# Altium schematic sheet HCMS-39XXTOP.SchDoc
size A4
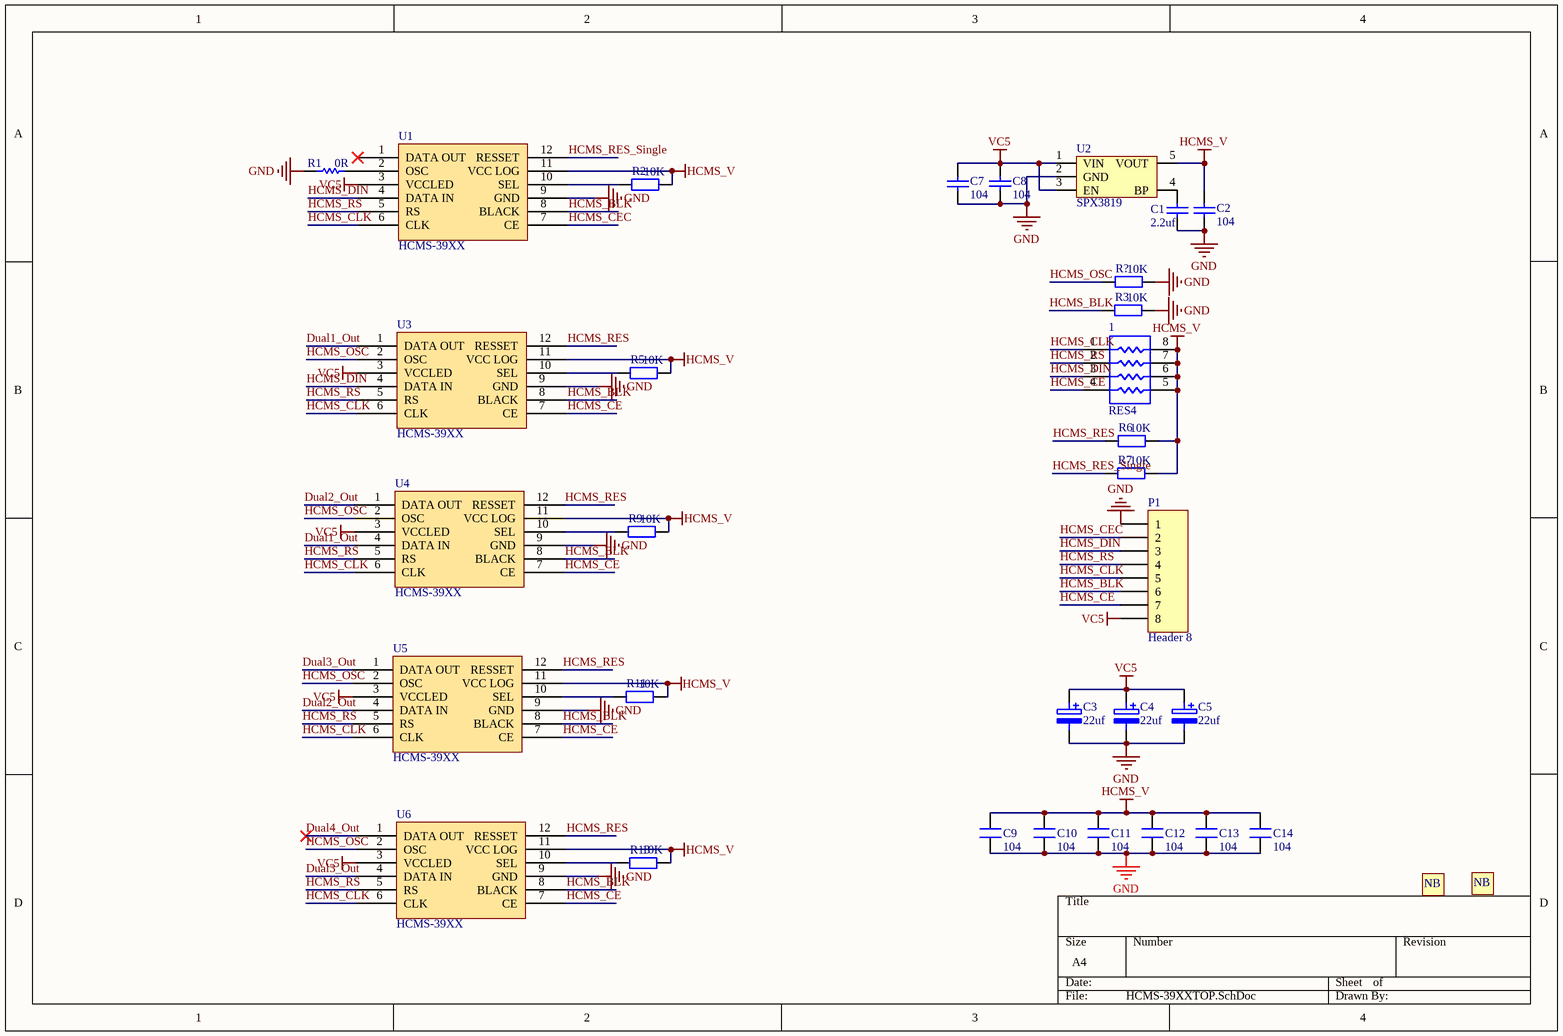
[diagram p0: HCMS-39XXTOP.SchDoc]

## Parts
1  RES4  [0603RES]
C1  value 2.2uf  [0603C]  (hidden comment: Cap)
C2  value 104  [0603C]  (hidden comment: Cap)
C3  22uf  [CM D(6.3*7.7)]
C4  22uf  [CM D(6.3*7.7)]
C5  22uf  [CM D(6.3*7.7)]
C7  value 104  [0603C]  (hidden comment: Cap)
C8  value 104  [0603C]  (hidden comment: Cap)
C9  104  [C 0603]
C10  104  [C 0603]
C11  104  [C 0603]
C12  104  [C 0603]
C13  104  [C 0603]
C14  104  [C 0603]
P1  Header 8  [connect-8p]
picture1  图标  [LCL-TOM]  (value not drawn)
picture2  图标  [Raptor]  (value not drawn)
R1  0R  [0603R]
R2  10K  [0603R]
R3  10K  [0603R]
R5  10K  [0603R]
R6  10K  [0603R]
R7  10K  [0603R]
R9  10K  [0603R]
R11  10K  [0603R]
R13  10K  [0603R]
R?  10K  [0603R]
U1  HCMS-39XX  [HCMS-39XX]
U2  SPX3819  [SOT23-5N]
U3  HCMS-39XX  [HCMS-39XX]
U4  HCMS-39XX  [HCMS-39XX]
U5  HCMS-39XX  [HCMS-39XX]
U6  HCMS-39XX  [HCMS-39XX]

## Nets
GND: C1.1 C2.1 C3.2 C4.2 C5.2 C7.1 C8.1 C9.1 C10.1 C11.1 C12.1 C13.1 C14.1 P1.1 R1.1 R3.1 R?.1 U1.9(GND) U2.2(GND) U3.9(GND) U4.9(GND) U5.9(GND) U6.9(GND)
HCMS_V: 1.5 1.6 1.7 1.8 C2.2 C9.2 C10.2 C11.2 C12.2 C13.2 C14.2 R2.1 R5.1 R6.1 R7.1 R9.1 R11.1 R13.1 U1.11(VCC_LOG) U2.5(VOUT) U3.11(VCC_LOG) U4.11(VCC_LOG) U5.11(VCC_LOG) U6.11(VCC_LOG)
VC5: C3.1 C4.1 C5.1 C7.2 C8.2 P1.8 U1.3(VCCLED) U2.1(VIN) U2.3(EN) U3.3(VCCLED) U4.3(VCCLED) U5.3(VCCLED) U6.3(VCCLED)
Dual1_Out: U3.1(DATA_OUT) U4.4(DATA_IN)
Dual2_Out: U4.1(DATA_OUT) U5.4(DATA_IN)
Dual3_Out: U5.1(DATA_OUT) U6.4(DATA_IN)
Dual4_Out: U6.1(DATA_OUT)
HCMS_BLK: P1.6 R3.2 U1.8(BLACK) U3.8(BLACK) U4.8(BLACK) U5.8(BLACK) U6.8(BLACK)
HCMS_CE: 1.4 P1.7 U3.7(CE) U4.7(CE) U5.7(CE) U6.7(CE)
HCMS_CEC: P1.2 U1.7(CE)
HCMS_CLK: 1.1 P1.5 U1.6(CLK) U3.6(CLK) U4.6(CLK) U5.6(CLK) U6.6(CLK)
HCMS_DIN: 1.3 P1.3 U1.4(DATA_IN) U3.4(DATA_IN)
HCMS_OSC: R?.2 U3.2(OSC) U4.2(OSC) U5.2(OSC) U6.2(OSC)
HCMS_RES: R6.2 U3.12(RESSET) U4.12(RESSET) U5.12(RESSET) U6.12(RESSET)
HCMS_RES_Single: R7.2 U1.12(RESSET)
HCMS_RS: 1.2 P1.4 U1.5(RS) U3.5(RS) U4.5(RS) U5.5(RS) U6.5(RS)
NetC1_2: C1.2 U2.4(BP)
NetR1_2: R1.2 U1.2(OSC)
NetR2_2: R2.2 U1.10(SEL)
NetR5_2: R5.2 U3.10(SEL)
NetR9_2: R9.2 U4.10(SEL)
NetR11_2: R11.2 U5.10(SEL)
NetR13_2: R13.2 U6.10(SEL)

Not connected (* = marked no-connect by the designer): U1 1(DATA_OUT)*

## Notes on the sheet
- (in symbol SP) NB

## Library data of the parts
C1 C2 C7 C8 = Cap: Polarized Capacitor (Radial); Published: 8-Jun-2000; Revision: July-2002: Re-released for DXP Platform.; Publisher: Altium Limited
C3-C5 = ELECTRO2
C9-C14 = 0603C
P1 = Header 8: Header, 8-Pin; LatestRevisionDate: 17-Jul-2002; LatestRevisionNote: Re-released for DXP Platform.; Publisher: Altium Limited
picture1 picture2 = SP
R1 = 0603r
R2 R3 R5-R7 R9 R11 R13 R? = Res2: Resistor; Published: 8-Jun-2000; LatestRevisionDate: 17-Jul-2002; LatestRevisionNote: Re-released for DXP Platform.; Publisher: Altium Limited
U2 = RT9193-33: 3.3V超低压差LDO